# Altium schematic sheet LowVoltage.SchDoc: Low Voltage
size A; DocumentNumber: 3; SheetNumber: 3; SheetTotal: 22
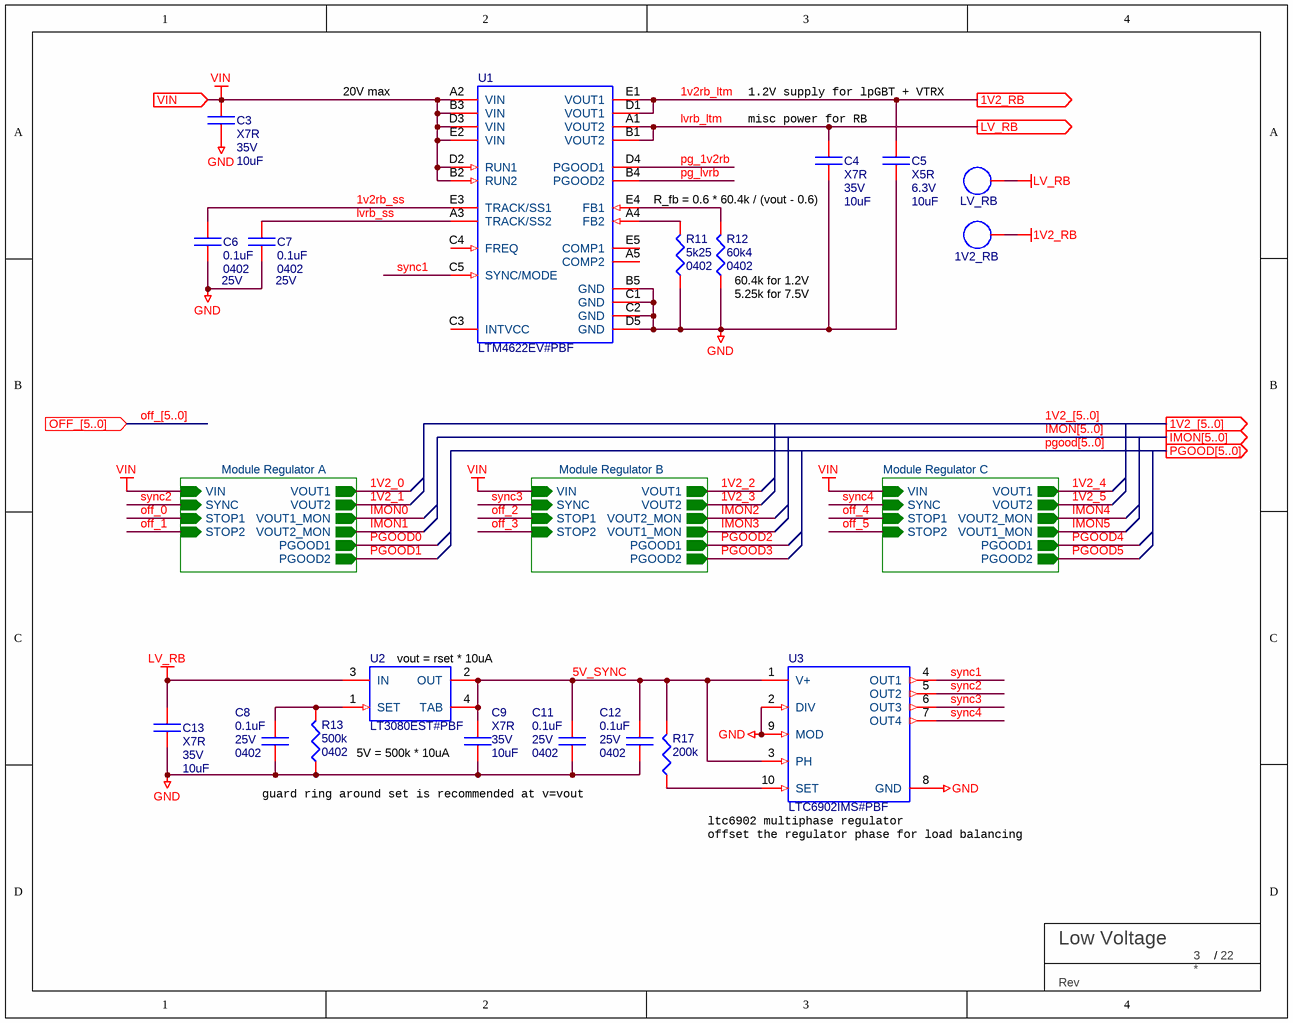
[diagram p0: LowVoltage.SchDoc]

## Parts
C3  TempCo: X7R  Voltage: 35V  [C_1206_IPC]  (hidden comment: 10uF)
C4  TempCo: X7R  Voltage: 35V  [C_1206_IPC]  (hidden comment: 10uF)
C5  TempCo: X5R  Voltage: 6.3V  [C_0603_IPC]  (hidden comment: 10uF)
C6  0.1uF  Voltage: 25V  Package: 0402  [C_0402_IPC_NOSILK]
C7  0.1uF  Voltage: 25V  Package: 0402  [C_0402_IPC_NOSILK]
C8  0.1uF  Voltage: 25V  Package: 0402  [C_0402_IPC_NOSILK]
C9  TempCo: X7R  Voltage: 35V  [C_1206_IPC]  (hidden comment: 10uF)
C11  0.1uF  Voltage: 25V  Package: 0402  [C_0402_IPC_NOSILK]
C12  0.1uF  Voltage: 25V  Package: 0402  [C_0402_IPC_NOSILK]
C13  TempCo: X7R  Voltage: 35V  [C_1206_IPC]  (hidden comment: 10uF)
R11  5k25  Footprint: 0402  [R_0402_IPC]
R12  60k4  Package: 0402  [R_0402_IPC]
R13  500k  Footprint: 0402  [R_0402_IPC]
R17  Parameter 1: 200k  [resc1005n]  (hidden comment: ERJ-2GEJ201X)
TBLOCK?  BU Title block  (value not drawn)  (graphical)
TP5  LV_RB  [testpoint]  (no BOM)
TP6  1V2_RB  [testpoint]  (no BOM)
U1  LTM4622EV#PBF  [LT-LGA-25-6250X6250X1820_V]
U2  LT3080EST#PBF  [LT-ST-3-SOT-223_N]
U3  LTC6902IMS#PBF  [FP-MS-10-05-08-1661-MFG]

## Sub-sheets
Module Regulator A = ModuleRegulator.SchDoc: SYNC (in), VOUT1 (out), VIN (in), STOP2 (in), STOP1 (in), VOUT2 (out), VOUT2_MON (out), VOUT1_MON (out), PGOOD1 (out), PGOOD2 (out)
Module Regulator B = ModuleRegulator.SchDoc: SYNC (in), VIN (in), STOP1 (in), STOP2 (in), VOUT1 (out), VOUT2 (out), VOUT2_MON (out), VOUT1_MON (out), PGOOD1 (out), PGOOD2 (out)
Module Regulator C = ModuleRegulator.SchDoc: SYNC (in), VIN (in), STOP1 (in), STOP2 (in), VOUT1 (out), VOUT2 (out), VOUT2_MON (out), VOUT1_MON (out), PGOOD1 (out), PGOOD2 (out)

## Ports
1V2_[5..0] (out), 1V2_RB (out), IMON[5..0] (out), LV_RB (out), OFF_[5..0] (in), PGOOD[5..0] (out), VIN (in)

## Nets
1V2_RB: TP6.1(TP)
GND: C3.2 C4.2 C5.2 C6.2 C7.2 C8.2 C9.2 C11.2 C12.2 C13.2 R11.1 R12.1 R13.1 U1.B5(GND) U1.C1(GND) U1.C2(GND) U1.D5(GND) U3.2(DIV) U3.8(GND) U3.9(MOD)
LV_RB: C13.1 TP5.1(TP) U2.3(IN)
VIN: C3.1 U1.A2(VIN) U1.B2(RUN2) U1.B3(VIN) U1.D2(RUN1) U1.D3(VIN) U1.E2(VIN) ; port VIN, sheet Module Regulator A/VIN, sheet Module Regulator B/VIN, sheet Module Regulator C/VIN
1V2_0: sheet Module Regulator A/VOUT1
1V2_1: sheet Module Regulator A/VOUT2
1V2_2: sheet Module Regulator B/VOUT1
1V2_3: sheet Module Regulator B/VOUT2
1V2_4: sheet Module Regulator C/VOUT1
1V2_5: sheet Module Regulator C/VOUT2
1v2rb_ltm: C5.1 U1.D1(VOUT1) U1.E1(VOUT1) ; port 1V2_RB
1v2rb_ss: C6.1 U1.E3(TRACK/SS1)
5V_SYNC: C9.1 C11.1 C12.1 R17.2 U2.2(OUT) U2.4(TAB) U3.1(V+) U3.3(PH)
IMON0: sheet Module Regulator A/VOUT1_MON
IMON1: sheet Module Regulator A/VOUT2_MON
IMON2: sheet Module Regulator B/VOUT2_MON
IMON3: sheet Module Regulator B/VOUT1_MON
IMON4: sheet Module Regulator C/VOUT2_MON
IMON5: sheet Module Regulator C/VOUT1_MON
lvrb_ltm: C4.1 U1.A1(VOUT2) U1.B1(VOUT2) ; port LV_RB
lvrb_ss: C7.1 U1.A3(TRACK/SS2)
off_0: sheet Module Regulator A/STOP1
off_1: sheet Module Regulator A/STOP2
off_2: sheet Module Regulator B/STOP1
off_3: sheet Module Regulator B/STOP2
off_4: sheet Module Regulator C/STOP1
off_5: sheet Module Regulator C/STOP2
pg_1v2rb: U1.D4(PGOOD1)
pg_lvrb: U1.B4(PGOOD2)
PGOOD0: sheet Module Regulator A/PGOOD1
PGOOD1: sheet Module Regulator A/PGOOD2
PGOOD2: sheet Module Regulator B/PGOOD1
PGOOD3: sheet Module Regulator B/PGOOD2
PGOOD4: sheet Module Regulator C/PGOOD1
PGOOD5: sheet Module Regulator C/PGOOD2
sync1: U1.C5(SYNC/MODE) U3.4(OUT1)
sync2: U3.5(OUT2) ; sheet Module Regulator A/SYNC
sync3: U3.6(OUT3) ; sheet Module Regulator B/SYNC
sync4: U3.7(OUT4) ; sheet Module Regulator C/SYNC
NetC8_1: C8.1 R13.2 U2.1(SET)
NetR11_2: R11.2 U1.A4(FB2)
NetR12_2: R12.2 U1.E4(FB1)
NetR17_1: R17.1 U3.10(SET)

Not connected (* = marked no-connect by the designer): U1 A5(COMP2) C3(INTVCC) C4(FREQ) E5(COMP1)

## Buses and harness runs
bus 1V2_[5..0] = port 1V2_[5..0]
bus IMON[5..0] = port IMON[5..0]
bus off_[5..0] = port OFF_[5..0]
bus pgood[5..0] = port PGOOD[5..0]

## Notes on the sheet
- 20V max
- 1.2V supply for lpGBT + VTRX
- (near C4) misc power for RB
- R_fb = 0.6 * 60.4k / (vout - 0.6)
- (near R12) 60.4k for 1.2V
- (near R12) 5.25k for 7.5V
- (near U2) vout = rset * 10uA
- 5V = 500k * 10uA
- guard ring around set is recommended at v=vout
- (near U3) offset the regulator phase for load balancing
- (near U3) ltc6902 multiphase regulator
- (in symbol TITLE_BLOCK_BU) /; Rev

## Library data of the parts
C3 C4 C9 C13 = C-CER-E6-10uF-1206-35V-X7R: CAP CER 10UF 35V X7R 1206; Supplier 1: Digi-Key; VALUE: 10uF; Supplier Part Number 1: 587-3007-1-ND
C5 = C-CER-E6-10uF-0603-6.3V-X5R: CAP CER 10UF 6.3V X5R 0603; Supplier 1: Digi-Key; Supplier Part Number 1: 490-16349-1-ND; VALUE: 10uF
C6-C8 C11 C12 = C-CER-E5-0.1uF-0402-25V-X7R: GRM155R71E104ME14D; TempCo: X7R
R11 = R-E3-5k25-0402-1%: RES SMD 5.25K OHM 1% 1/16W 0402
R12 = R-E3-60K4-0402-1%: RES SMD 60.4k Ohm 1% 1/16W 0402; Part Number: RC0402FR-0760K4L
R13 = R-E5-500k0-0402-1%: RES SMD 500K OHM 1% 1/16W 0402
R17 = R1: FILM RESISTOR; Text Field2: 5%
TBLOCK? = TITLE_BLOCK_BU
TP5 TP6 = TP: TEST POINT 40MIL DIA.
U1 = LTM4622EV: Dual Ultrathin Step-Down DC/DC uModule Regulator, 2.5 A, 3.6 to 20 V, -40 to 125 degC, 25-Pin LGA, RoHS, Tray; Manufacturer: LinearTechnology; Manufacturer 1: Linear Technology/Analog Devices; Voltage - Input (Min): 3.6V; Voltage - Output 1: 0.6~5.5V; Package Version: Rev. 0, 06/2013; Current - Output (Max): 2.5A; Number of Outputs: 1; Voltage - Input (Max): 20V; Type: Non-IsolatedPoLModule; Power (Watts) - Max: -; Mounting Technology: SurfaceMount; Applications: ITE(Commercial); Series: µModule®; Category: PowerSupplies-BoardMount; Package Description: 25-Pin LGA, Body 6.25 x 6.25 mm, Pitch 1.27 mm; Package / Case: 25-LGA; Size / Dimension: 0.25"Lx0.25"Wx0.07"H(6.3mmx6.3mmx1.8mm); Family: DCDCConverters; Mounting Type: SurfaceMount; Datasheet Version: Rev. B, 01/2016; Manufacturer URL: http://www.linear.com/; Operating Temperature: -40°C~125°C; Efficiency: -; Voltage - Output 2: -; Power (Watts) - Manufacture Series: -; Features: OCP,OTP,OVP; Packaging: Tray; Package URL: http://www.linear.com/docs/43379; Package Reference: LGA-25; Datasheet URL: http://cds.linear.com/docs/en/datasheet/4622fb.pdf; Voltage - Isolation: -; Voltage - Output 3: -; Manufacturer Part Number 1: LTM4622EV#PBF
U2 = LT3080EST#PBF: Adjustable 1.1 A Single Resistor Low Dropout Regulator, 0.3 mA Isupply, 3-pin SOT223 (ST-3), -40 to 125 degC, Pb-Free; Manufacturer: Linear Technology; Manufacturer 1: Analog Devices / Linear Technology; Initial Accuracy(%): 1; Vin Max(V): 36; Vin Min(V): 1.2; Extended Temp: E, I; Isupply(mA): 0.3; Mounting Technology: Surface Mount; DatasheetVersion: Rev. F; ComponentLink1URL: http://www.linear.com/; PartNumber: LT3080EST#PBF; ComponentLink2Description: Datasheet; ComponentLink3URL: http://cds.linear.com/docs/en/packaging/SOT_3_05-08-1630.pdf; PackageDescription: 3-Pin Plastic SOT-223, Body 3.505 x 6.505 mm, Pitch 2.3 mm; PackageVersion: Jun-10; ComponentLink2URL: http://cds.linear.com/docs/en/datasheet/3080fc.pdf; RoHS: TRUE; ComponentLink3Description: Package Specification; PackageReference: ST-3; ComponentLink1Description: Manufacturer URL; Manufacturer Part Number 1: LT3080EST#PBF
U3 = LTC6902IMS: IC OSC SILICON PROG 10MSOP; Manufacturer: Analog Devices; Manufacturer 1: Analog Devices / Linear Technology; Min Supply Voltage: 2.7V; Standoff Height: 0.0508mm; Max Supply Voltage: 5.5V; Number Of Timers/Counters: 1; Frequency: 20MHz; Max Junction Temp: +150°C; Nominal Supply Current: 0.2-2.5mA; Automotive: No; Temperature Range Low: -40°C; Footprint Url: https://www.analog.com/media/en/package-pcb-resources/package/pkg_pdf/ltc-legacy-msop/05081661_F_MS.pdf; Package: MS-10-05-08-1661; ComponentLink2Description: Datasheet; Category: IC; ComponentLink2URL: https://www.analog.com/media/en/technical-documentation/data-sheets/6902f.pdf; RoHS: TRUE; Device Class L2: Clock and Timing; Temperature: -40°C to +85°C; Temperature Range High: +85°C; Lead Free: Yes; Device Class L1: Integrated Circuits (ICs); Ipc Land Pattern Name: SOP50P490X110-10; Height: 1.1mm; Device Class L3: Timers and Oscillators; Manufacturer Part Number: LTC6902IMS#PBF; Digikey Description: IC OSC SILICON PROG 10MSOP; Octopart: https://octopart.com/ltc6902ims%23pbf-analog+devices-88320276; Manufacturer Part Number 1: LTC6902IMS#PBF